# Altium schematic sheet 6_audioCodec.SchDoc
size A4
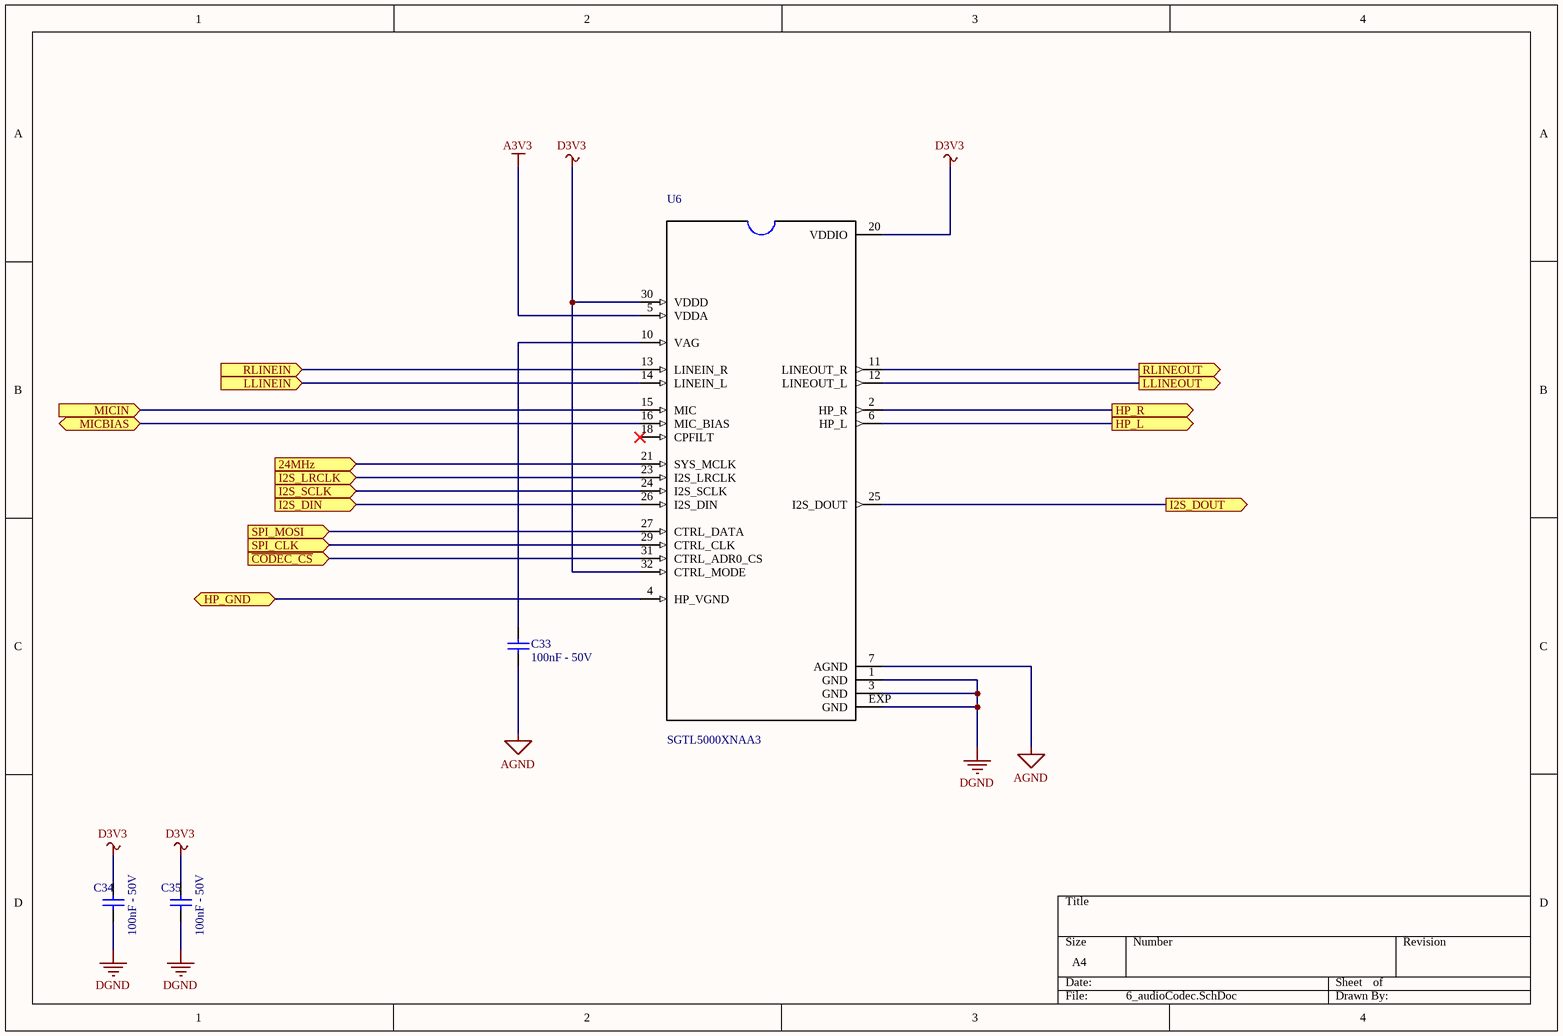
[diagram p0: 6_audioCodec.SchDoc]

## Parts
C33  VALOR: 100nF - 50V  [SMD0805-CAP]  (hidden comment: Capacitor 100 nF - 10%)
C34  VALOR: 100nF - 50V  [SMD0805-CAP]  (hidden comment: Capacitor 100 nF - 10%)
C35  VALOR: 100nF - 50V  [SMD0805-CAP]  (hidden comment: Capacitor 100 nF - 10%)
U6  SGTL5000XNAA3  [QFN50P500X500X100-33N_SGTL5000XNAA3(Primary)]

## Ports
24MHz (in), HP_GND (bidir), HP_L (out), HP_R (out), I2S_DIN (in), I2S_DOUT (out), I2S_LRCLK (in), I2S_SCLK (in), LLINEIN (in), LLINEOUT (out), MICBIAS (bidir), MICIN (in), RLINEIN (in), RLINEOUT (out), SPI_CLK (in), SPI_MOSI (in), ~{CODEC_CS} (in)

## Nets
A3V3: U6.5(VDDA)
AGND: C33.1 U6.7(AGND)
D3V3: C34.1 C35.1 U6.20(VDDIO) U6.30(VDDD) U6.32(CTRL_MODE)
DGND: C34.2 C35.2 U6.1(GND) U6.3(GND) U6.EXP(GND)
24MHz: U6.21(SYS_MCLK) ; port 24MHz
~{CODEC_CS}: U6.31(CTRL_ADR0_CS) ; port ~{CODEC_CS}
HP_GND: U6.4(HP_VGND) ; port HP_GND
HP_L: U6.6(HP_L) ; port HP_L
HP_R: U6.2(HP_R) ; port HP_R
I2S_DIN: U6.26(I2S_DIN) ; port I2S_DIN
I2S_DOUT: U6.25(I2S_DOUT) ; port I2S_DOUT
I2S_LRCLK: U6.23(I2S_LRCLK) ; port I2S_LRCLK
I2S_SCLK: U6.24(I2S_SCLK) ; port I2S_SCLK
LLINEIN: U6.14(LINEIN_L) ; port LLINEIN
LLINEOUT: U6.12(LINEOUT_L) ; port LLINEOUT
MICBIAS: U6.16(MIC_BIAS) ; port MICBIAS
MICIN: U6.15(MIC) ; port MICIN
RLINEIN: U6.13(LINEIN_R) ; port RLINEIN
RLINEOUT: U6.11(LINEOUT_R) ; port RLINEOUT
SPI_CLK: U6.29(CTRL_CLK) ; port SPI_CLK
SPI_MOSI: U6.27(CTRL_DATA) ; port SPI_MOSI
NetC33_2: C33.2 U6.10(VAG)

Not connected (* = marked no-connect by the designer): U6 18(CPFILT)*

## Library data of the parts
C33-C35 = 100nF - 50V - 10% - 0805 - 580: Capacitor 100nF, 10%, SMD 0805; MANUFACTURER: AVX; PARTNUMBER: 08055C104KAT2A; CODIGO: 580; EMBALAGEM: REEL; FORNECEDOR: VARIOS; DESC: CAP 100nF, 50V, SMD0805, 10%, X7R, CERAMICO MULTICAMADA; TARGET MÁX U$: $0,0041; ComponentLink1Description: Datasheet; ComponentLink1URL: http://www.avx.com/docs/catalogs/cx7r.pdf; ComponentLink2Description: HOME AVX; ComponentLink2URL: http://www.avx.com/; ENCAPSULAMENTO: SMD0805; FACTORY PACK: 4000; LOCALIZAÇÃO: *; Supplier 1: Mouser; Supplier Part Number 1: 08055C104KAT2A; NCM: 8532.21.11
U6 = SGTL5000XNAA3: Audio Codec , Ultra Low-Power, 4 mw for DAC-to-HP, 98 dB SNR and -80 dB THD+N, QFN 32, Tray; MF: NXP Semiconductors; Package: QFN-32 NXP Semiconductors; MP: SGTL5000XNAA3; SnapEDA_Link: https://www.snapeda.com/parts/SGTL5000XNAA3/NXP%2520Semiconductors/view-part/?ref=snap; Availability: Good; Price: 2.26 USD; Value: *